# EAGLE design frontpanel1_1 (EAGLE 7.7.0)
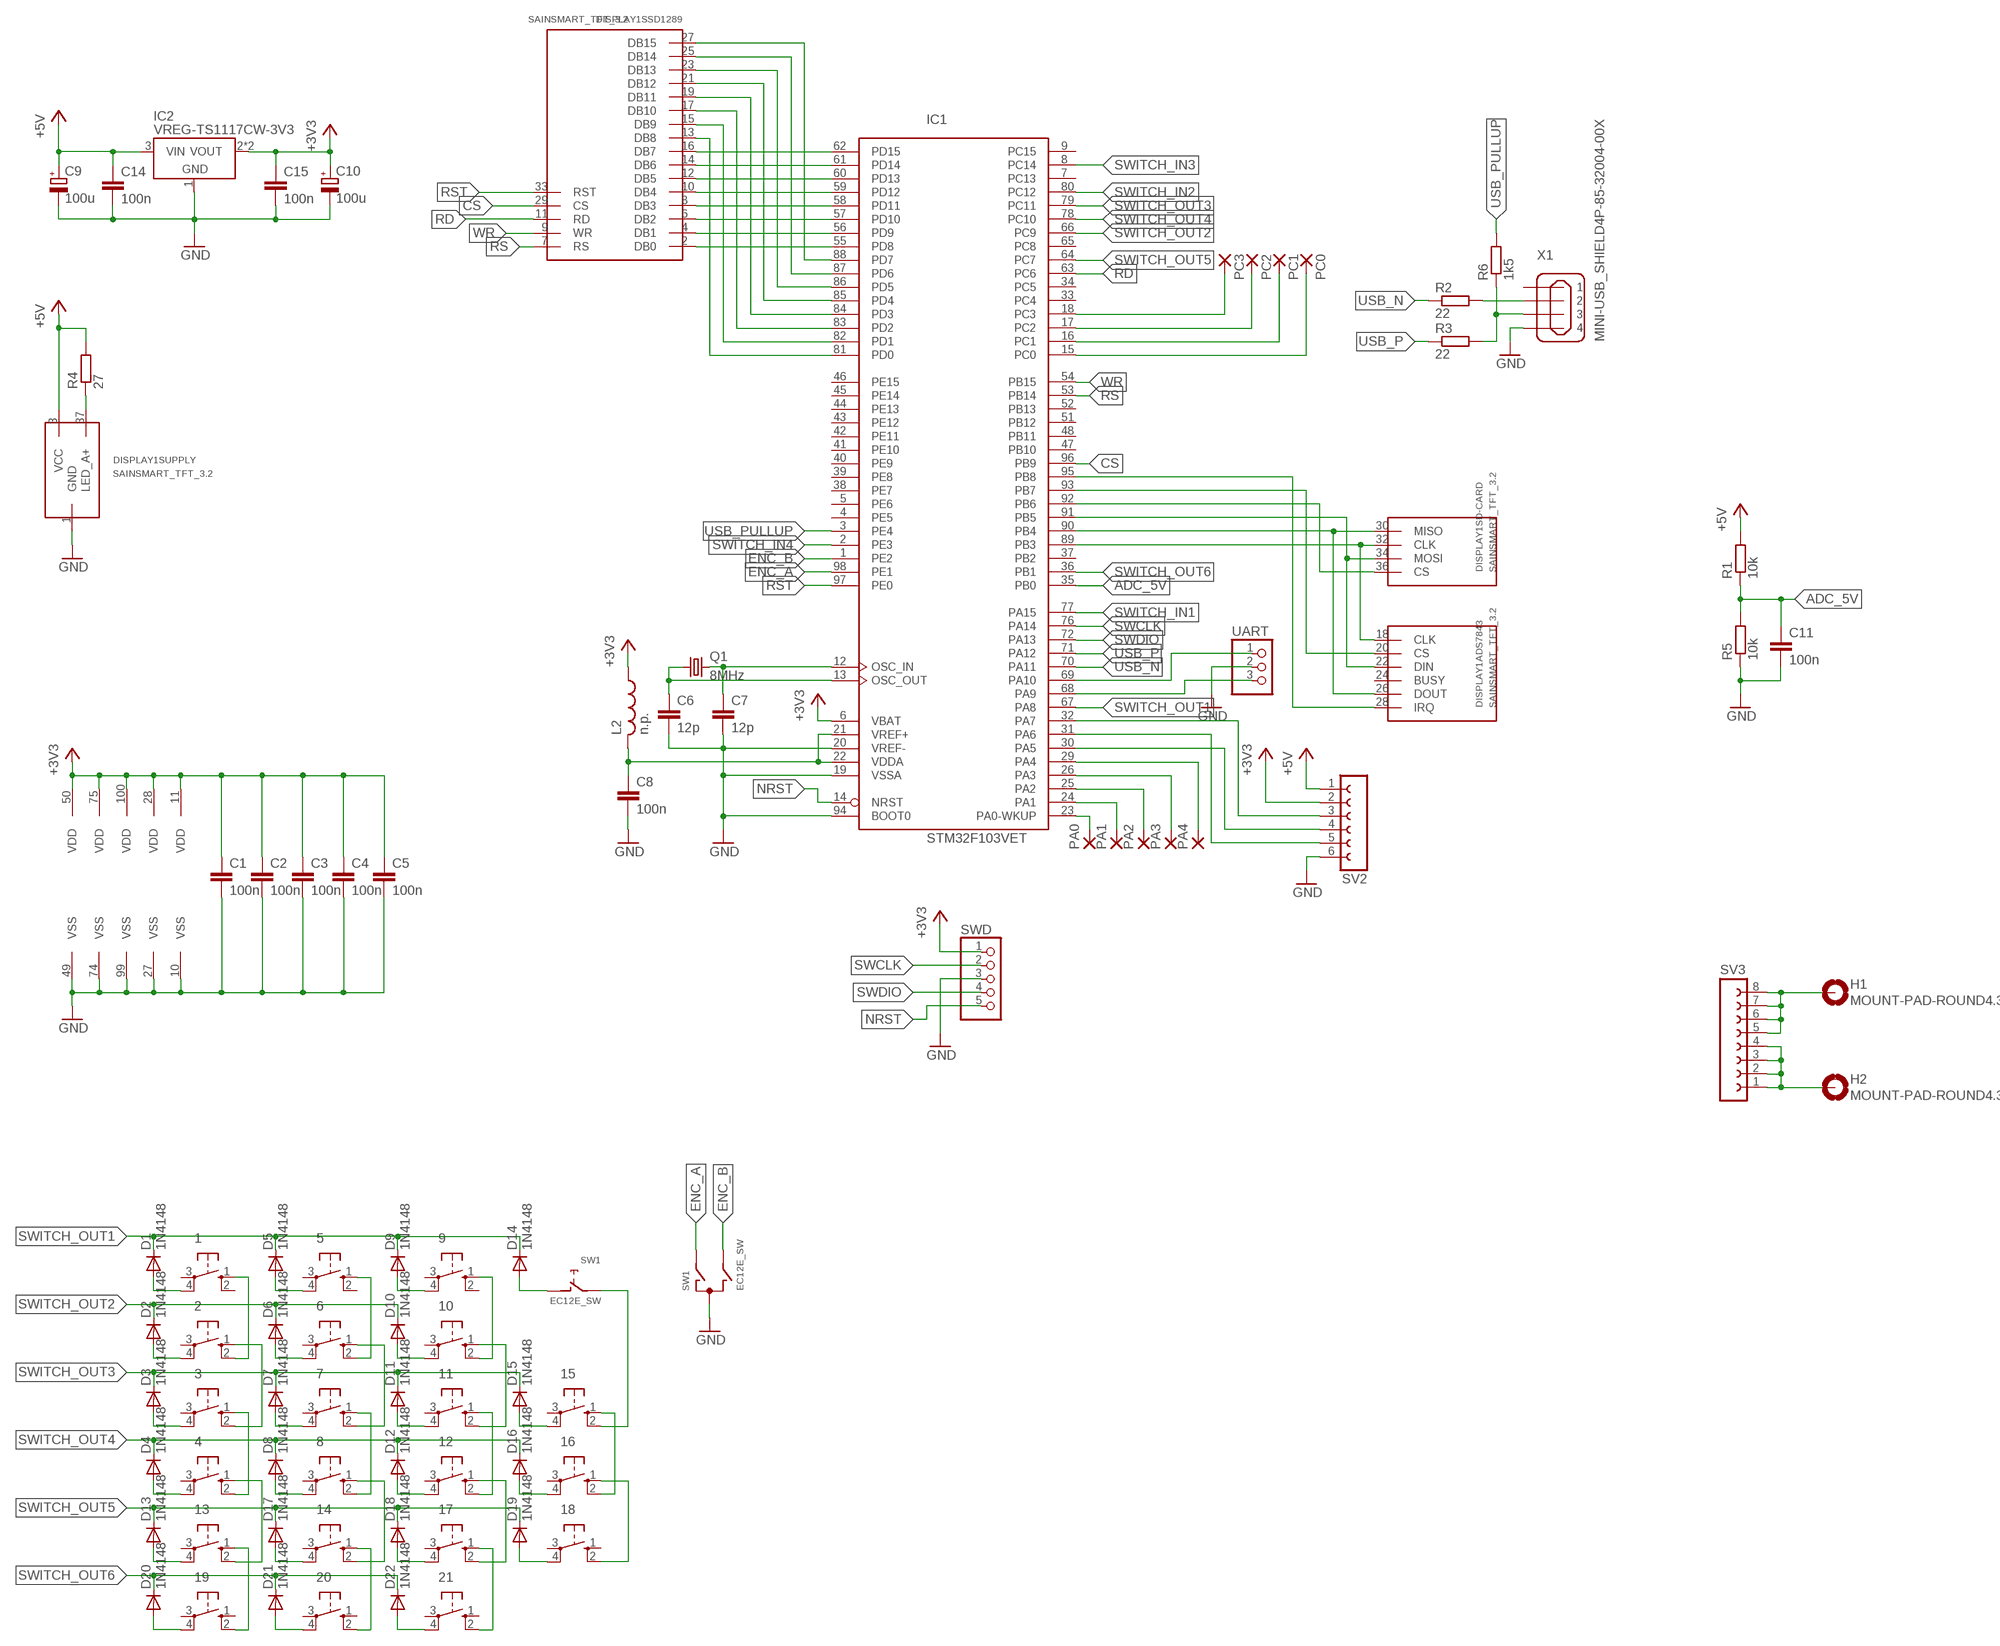
[diagram p0: schematic, sheet 1]

## Parts
1  10-XXSMD  [SMD]
2  10-XXSMD  [SMD]
3  10-XXSMD  [SMD]
4  10-XXSMD  [SMD]
5  10-XXSMD  [SMD]
6  10-XXSMD  [SMD]
7  10-XXSMD  [SMD]
8  10-XXSMD  [SMD]
9  10-XXSMD  [SMD]
10  10-XXSMD  [SMD]
11  10-XXSMD  [SMD]
12  10-XXSMD  [SMD]
13  10-XXSMD  [SMD]
14  10-XXSMD  [SMD]
15  10-XXSMD  [SMD]
16  10-XXSMD  [SMD]
17  10-XXSMD  [SMD]
18  10-XXSMD  [SMD]
19  10-XXSMD  [SMD]
20  10-XXSMD  [SMD]
21  10-XXSMD  [SMD]
C1  100n  C-EUC0603K  [C0603K]
C2  100n  C-EUC0603K  [C0603K]
C3  100n  C-EUC0603K  [C0603K]
C4  100n  C-EUC0603K  [C0603K]
C5  100n  C-EUC0603K  [C0603K]
C6  12p  C-EUC0603K  [C0603K]
C7  12p  C-EUC0603K  [C0603K]
C8  100n  C-EUC0603K  [C0603K]
C9  100u  CPOL-EU153CLV-0505  [153CLV-0505]
C10  100u  CPOL-EU153CLV-0505  [153CLV-0505]
C11  100n  C-EUC0603K  [C0603K]
C14  100n  C-EUC0603K  [C0603K]
C15  100n  C-EUC0603K  [C0603K]
D1  1N4148  DIODE-SOD323-W  [SOD323-W]
D2  1N4148  DIODE-SOD323-W  [SOD323-W]
D3  1N4148  DIODE-SOD323-W  [SOD323-W]
D4  1N4148  DIODE-SOD323-W  [SOD323-W]
D5  1N4148  DIODE-SOD323-W  [SOD323-W]
D6  1N4148  DIODE-SOD323-W  [SOD323-W]
D7  1N4148  DIODE-SOD323-W  [SOD323-W]
D8  1N4148  DIODE-SOD323-W  [SOD323-W]
D9  1N4148  DIODE-SOD323-W  [SOD323-W]
D10  1N4148  DIODE-SOD323-W  [SOD323-W]
D11  1N4148  DIODE-SOD323-W  [SOD323-W]
D12  1N4148  DIODE-SOD323-W  [SOD323-W]
D13  1N4148  DIODE-SOD323-W  [SOD323-W]
D14  1N4148  DIODE-SOD323-W  [SOD323-W]
D15  1N4148  DIODE-SOD323-W  [SOD323-W]
D16  1N4148  DIODE-SOD323-W  [SOD323-W]
D17  1N4148  DIODE-SOD323-W  [SOD323-W]
D18  1N4148  DIODE-SOD323-W  [SOD323-W]
D19  1N4148  DIODE-SOD323-W  [SOD323-W]
D20  1N4148  DIODE-SOD323-W  [SOD323-W]
D21  1N4148  DIODE-SOD323-W  [SOD323-W]
D22  1N4148  DIODE-SOD323-W  [SOD323-W]
DISPLAY1  SAINSMART_TFT_3.2  [SAINSMART_TFT_3.2]
H1  MOUNT-PAD-ROUND4.3  [4,3-PAD]
H2  MOUNT-PAD-ROUND4.3  [4,3-PAD]
IC1  STM32F103VET  [LQFP100]
IC2  VREG-TS1117CW-3V3  [SOT223]
L2  n.p.  INDUCTOR0603  [R0603]
PA0  SMD2  [SMD1,27-2,54]
PA1  SMD2  [SMD1,27-2,54]
PA2  SMD2  [SMD1,27-2,54]
PA3  SMD2  [SMD1,27-2,54]
PA4  SMD2  [SMD1,27-2,54]
PC0  SMD2  [SMD1,27-2,54]
PC1  SMD2  [SMD1,27-2,54]
PC2  SMD2  [SMD1,27-2,54]
PC3  SMD2  [SMD1,27-2,54]
Q1  8MHz  CRYSTALSM49  [SM49]
R1  10k  R-EU_R0603  [R0603]
R2  22  R-EU_R0603  [R0603]
R3  22  R-EU_R0603  [R0603]
R4  27  R-EU_R1206  [R1206]
R5  10k  R-EU_R0603  [R0603]
R6  1k5  R-EU_R0603  [R0603]
SV2  FE06-1  [FE06]
SV3  FE08-1  [FE08]
SW1  EC12E_SW  [ALPS_EC12E_SW]
SWD  PINHD-1X5  [1X05]
UART  PINHD-1X3  [1X03]
X1  MINI-USB_SHIELD4P-85-32004-00X  [85-32004-00X]

## Nets
+3V3: C1.1 C2.1 C3.1 C4.1 C5.1 C10.+ C15.1 IC1.6(VBAT) IC1.11(VDD) IC1.28(VDD) IC1.50(VDD) IC1.75(VDD) IC1.100(VDD) IC2.2(VOUT) IC2.4(VOUT) L2.1 SV2.2 SWD.1
+5V: C9.+ C14.1 DISPLAY1.3(SUPPLY:VCC) IC2.3(VIN) R1.2 R4.2 SV2.1
ADC_5V: C11.1 IC1.35(PB0) R1.1 R5.2
CS: DISPLAY1.29(SSD1289:CS) IC1.96(PB9)
ENC_A: IC1.98(PE1) SW1.A
ENC_B: IC1.1(PE2) SW1.B
EXT4: C8.1 IC1.21(VREF+) IC1.22(VDDA) L2.2
GND: C1.2 C2.2 C3.2 C4.2 C5.2 C6.2 C7.2 C8.2 C9.- C10.- C11.2 C14.2 C15.2 DISPLAY1.1(SUPPLY:GND) IC1.10(VSS) IC1.19(VSSA) IC1.20(VREF-) IC1.27(VSS) IC1.49(VSS) IC1.74(VSS) IC1.94(BOOT0) IC1.99(VSS) IC2.1(GND) R5.1 SV2.6 SW1.C SWD.3 UART.2 X1.4
MISO: IC1.31(PA6) SV2.5
MOSI: IC1.32(PA7) SV2.3
N$1: IC1.15(PC0) PC0.1(P)
N$2: C7.1 IC1.12(OSC_IN) Q1.2
N$3: C6.1 IC1.13(OSC_OUT) Q1.1
N$4: DISPLAY1.2(SSD1289:DB0) IC1.55(PD8)
N$5: DISPLAY1.4(SSD1289:DB1) IC1.56(PD9)
N$6: DISPLAY1.6(SSD1289:DB2) IC1.57(PD10)
N$7: DISPLAY1.8(SSD1289:DB3) IC1.58(PD11)
N$8: DISPLAY1.10(SSD1289:DB4) IC1.59(PD12)
N$9: DISPLAY1.12(SSD1289:DB5) IC1.60(PD13)
N$10: DISPLAY1.14(SSD1289:DB6) IC1.61(PD14)
N$11: DISPLAY1.16(SSD1289:DB7) IC1.62(PD15)
N$12: DISPLAY1.15(SSD1289:DB9) IC1.82(PD1)
N$13: DISPLAY1.17(SSD1289:DB10) IC1.83(PD2)
N$14: DISPLAY1.13(SSD1289:DB8) IC1.81(PD0)
N$15: DISPLAY1.19(SSD1289:DB11) IC1.84(PD3)
N$16: DISPLAY1.21(SSD1289:DB12) IC1.85(PD4)
N$17: DISPLAY1.23(SSD1289:DB13) IC1.86(PD5)
N$18: DISPLAY1.25(SSD1289:DB14) IC1.87(PD6)
N$19: DISPLAY1.27(SSD1289:DB15) IC1.88(PD7)
N$20: 13.1(S) 19.2(S1)
N$21: 4.1(S) 13.2(S1)
N$22: 13.4(P1) D13.A
N$23: 14.4(P1) D17.A
N$24: 17.4(P1) D18.A
N$25: 18.4(P1) D19.A
N$26: 19.4(P1) D20.A
N$27: 20.4(P1) D21.A
N$28: 21.4(P1) D22.A
N$29: IC1.16(PC1) PC1.1(P)
N$30: IC1.17(PC2) PC2.1(P)
N$31: IC1.18(PC3) PC3.1(P)
N$32: IC1.23(PA0-WKUP) PA0.1(P)
N$33: 2.1(S) 3.2(S1)
N$34: 1.1(S) 2.2(S1)
N$35: 5.1(S) 6.2(S1)
N$36: 6.1(S) 7.2(S1)
N$37: IC1.24(PA1) PA1.1(P)
N$38: 8.1(S) 14.2(S1)
N$39: 14.1(S) 20.2(S1)
N$40: 17.1(S) 21.2(S1)
N$41: IC1.25(PA2) PA2.1(P)
N$42: R2.2 X1.2
N$43: R3.2 R6.1 X1.3
N$44: DISPLAY1.37(SUPPLY:LED_A+) R4.1
N$45: IC1.26(PA3) PA3.1(P)
N$46: DISPLAY1.22(ADS7843:DIN) DISPLAY1.34(SD-CARD:MOSI) IC1.91(PB5)
N$47: 4.4(P1) D4.A
N$48: 3.4(P1) D3.A
N$49: 2.4(P1) D2.A
N$50: 1.4(P1) D1.A
N$51: DISPLAY1.26(ADS7843:DOUT) DISPLAY1.30(SD-CARD:MISO) IC1.90(PB4)
N$52: DISPLAY1.18(ADS7843:CLK) DISPLAY1.32(SD-CARD:CLK) IC1.89(PB3)
N$53: 11.1(S) 12.2(S1)
N$54: 8.4(P1) D8.A
N$55: 7.4(P1) D7.A
N$56: 6.4(P1) D6.A
N$57: 5.4(P1) D5.A
N$58: 10.1(S) 11.2(S1)
N$59: 9.1(S) 10.2(S1)
N$60: 15.1(S) 16.2(S1)
N$61: 12.4(P1) D12.A
N$62: 11.4(P1) D11.A
N$63: 10.4(P1) D10.A
N$64: 9.4(P1) D9.A
N$65: IC1.29(PA4) PA4.1(P)
N$66: DISPLAY1.36(SD-CARD:CS) IC1.92(PB6)
N$67: DISPLAY1.20(ADS7843:CS) IC1.93(PB7)
N$68: 16.4(P1) D16.A
N$69: 15.4(P1) D15.A
N$70: D14.A SW1.D
N$72: DISPLAY1.28(ADS7843:IRQ) IC1.95(PB8)
N$123: 15.2(S1) SW1.E
NRST: IC1.14(NRST) SWD.5
OUT+: H2.B4,3(MOUNT) SV3.1 SV3.2 SV3.3 SV3.4
OUT-: H1.B4,3(MOUNT) SV3.5 SV3.6 SV3.7 SV3.8
RD: DISPLAY1.11(SSD1289:RD) IC1.63(PC6)
RS: DISPLAY1.7(SSD1289:RS) IC1.53(PB14)
RST: DISPLAY1.33(SSD1289:RST) IC1.97(PE0)
RX: IC1.69(PA10) UART.1
SCK: IC1.30(PA5) SV2.4
SWCLK: IC1.76(PA14) SWD.2
SWDIO: IC1.72(PA13) SWD.4
SWITCH_IN1: 3.1(S) 4.2(S1) IC1.77(PA15)
SWITCH_IN2: 7.1(S) 8.2(S1) IC1.80(PC12)
SWITCH_IN3: 12.1(S) 17.2(S1) IC1.8(PC14)
SWITCH_IN4: 16.1(S) 18.2(S1) IC1.2(PE3)
SWITCH_OUT1: D1.C D5.C D9.C D14.C IC1.67(PA8)
SWITCH_OUT2: D2.C D6.C D10.C IC1.66(PC9)
SWITCH_OUT3: D3.C D7.C D11.C D15.C IC1.79(PC11)
SWITCH_OUT4: D4.C D8.C D12.C D16.C IC1.78(PC10)
SWITCH_OUT5: D13.C D17.C D18.C D19.C IC1.64(PC7)
SWITCH_OUT6: D20.C D21.C D22.C IC1.36(PB1)
TX: IC1.68(PA9) UART.3
USB_N: IC1.70(PA11) R2.1
USB_P: IC1.71(PA12) R3.1
USB_PULLUP: IC1.3(PE4) R6.2
WR: DISPLAY1.9(SSD1289:WR) IC1.54(PB15)
Unconnected: 1.2(S1) 1.3(P) 2.3(P) 3.3(P) 4.3(P) 5.2(S1) 5.3(P) 6.3(P) 7.3(P) 8.3(P) 9.2(S1) 9.3(P) 10.3(P) 11.3(P) 12.3(P) 13.3(P) 14.3(P) 15.3(P) 16.3(P) 17.3(P) 18.1(S) 18.3(P) 19.1(S) 19.3(P) 20.1(S) 20.3(P) 21.1(S) 21.3(P) DISPLAY1.24(ADS7843:BUSY) IC1.4(PE5) IC1.5(PE6) IC1.7(PC13) IC1.9(PC15) IC1.33(PC4) IC1.34(PC5) IC1.37(PB2) IC1.38(PE7) IC1.39(PE8) IC1.40(PE9) IC1.41(PE10) IC1.42(PE11) IC1.43(PE12) IC1.44(PE13) IC1.45(PE14) IC1.46(PE15) IC1.47(PB10) IC1.48(PB11) IC1.51(PB12) IC1.52(PB13) IC1.65(PC8) SW1.GND1(G) SW1.GND2(G) X1.1 X1.M1(S1) X1.M2(S2)

## Library data of the parts
1-21 = switch-omron:10-XX: OMRON SWITCH
C1-C8 = rcl:C-EU: CAPACITOR, European symbol
C9 C10 = rcl:CPOL-EU: POLARIZED CAPACITOR, European symbol
C11 C14 C15 = resistormod:C-EU: CAPACITOR, European symbol
D1-D22 = diode:DIODE-: DIODE
DISPLAY1 = sainsmart:SAINSMART_TFT_3.2
H1 H2 = holes:MOUNT-PAD-ROUND: MOUNTING PAD, round
IC1 = micro-stm_v3:STM32F103V*T: ARM 32-bit Cortex™-M3 CPU 72 MHz maximum frequency 64 to 1028 Kbytes of Flash memory 20 to 96 kbytes of SRAM 80 GPIOs 2.0 to 3.6 V application supply
IC2 = we-power:VREG: Voltage Regulators (LDOs, Switching Converters...) LDOs Taiwan Semi TS1117 800mA max 15V - compatible On Semi NCP1117 1A max 20V - compatible Diodes AP2111H 0.6A max 6V (0.25V@0.6A) - compatible Diodes AP2114H 1A max 6V (0.45V@1A) Taiwan Semi TS9011 250mA max 12V - compatible Diodes AP2210 300mA max 15V - compatible Microchip MCP1700 250mA max 6.5V - compatible Microchip MCP1702 250mA max 13V - compatible Microchip MCP1703 250mA max 16V - compatible Microchip MCP1754 150mA max 16V Taiwan Semi TS5204 150mA max 16V (low noise) DC/DC Converter Modules Recom R-78Ex.x-1.0-W36 1A max 28V - compatible CUI V78xx-2000 2A max 18V Murata OKI-78SR-x.x/1.5-W36 1.5A max 36V
L2 = xmaker:INDUCTOR: Inductor
PA0 PA1-PA4 PC0 PC1-PC3 = wirepad:SMD2: SMD PAD
Q1 = crystal:CRYSTAL: CRYSTAL; OC_FARNELL: unknown; OC_NEWARK: unknown
R1-R6 = resistor:R-EU_: RESISTOR, European symbol
SV2 = con-lsta:FE06-1: FEMALE HEADER; OC_FARNELL: unknown; OC_NEWARK: unknown
SV3 = con-lsta:FE08-1: FEMALE HEADER; OC_FARNELL: unknown; OC_NEWARK: unknown
SW1 = switch-alps:EC12E_SW: ALPS rotary Encoder EC12E series with switch; MPN: EC12E2424407; OC_FARNELL: 1520813; OC_NEWARK: 74M1068
SWD = pinhead:PINHD-1X5: PIN HEADER
UART = pinhead:PINHD-1X3: PIN HEADER
X1 = con-cypressindustries:MINI-USB_SHIELD4P-: MINI USB 4 Pol. Source: www.cypressindustries.com; OC_FARNELL: unknown; OC_NEWARK: unknown

## Board
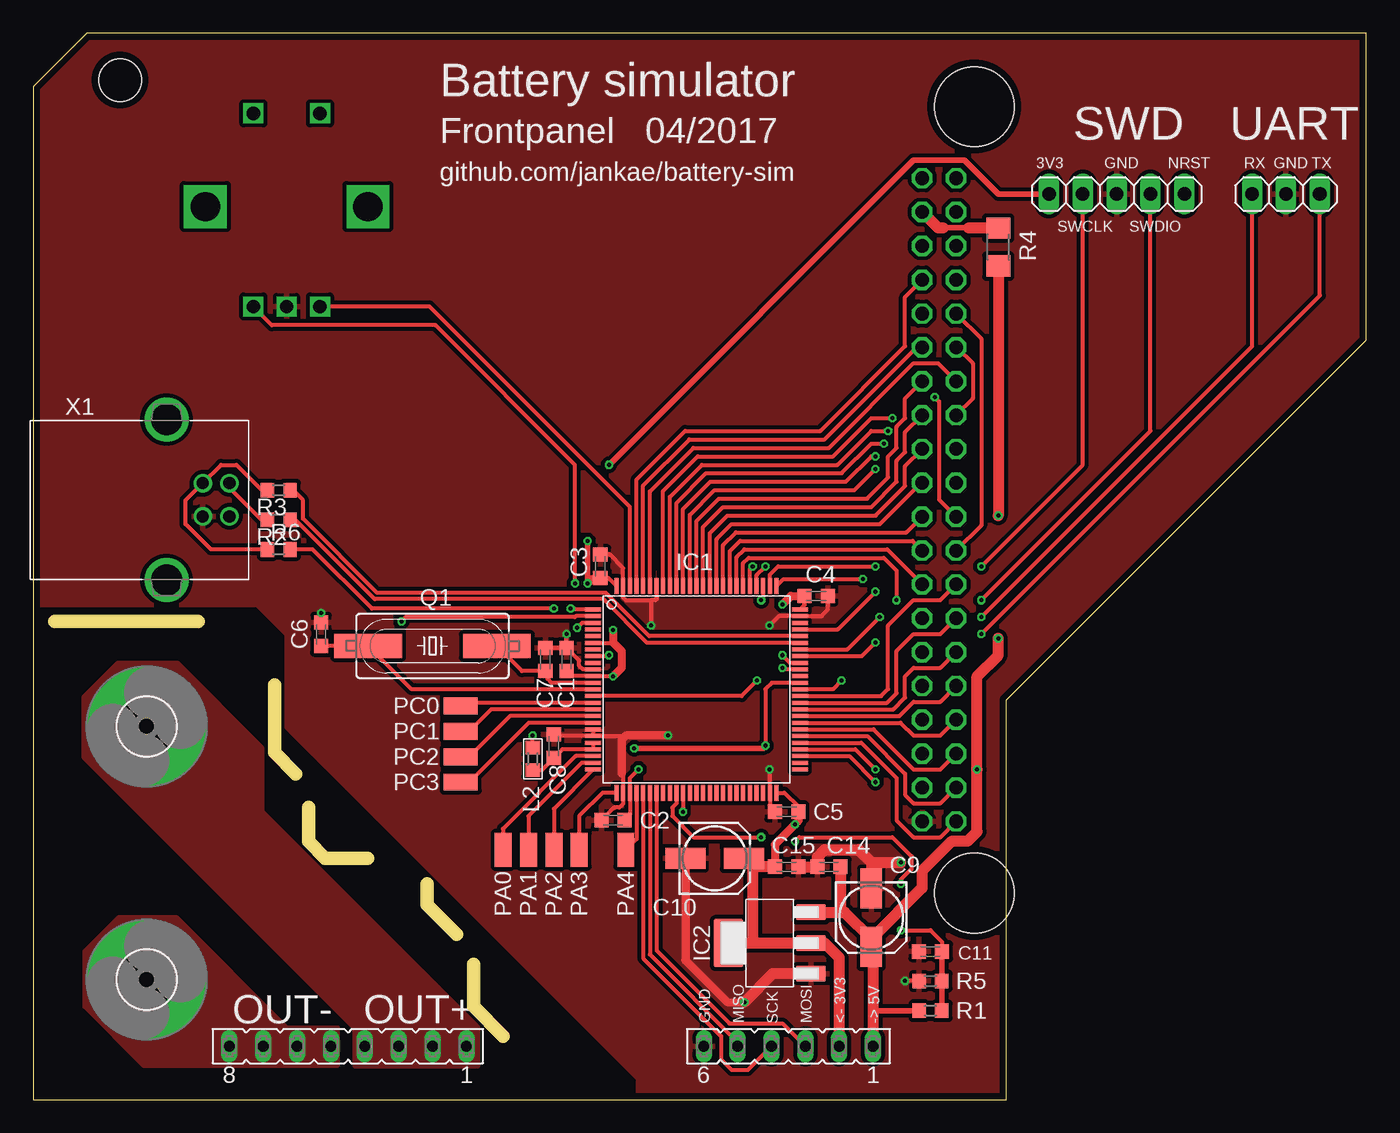
[diagram p1: board, top side]
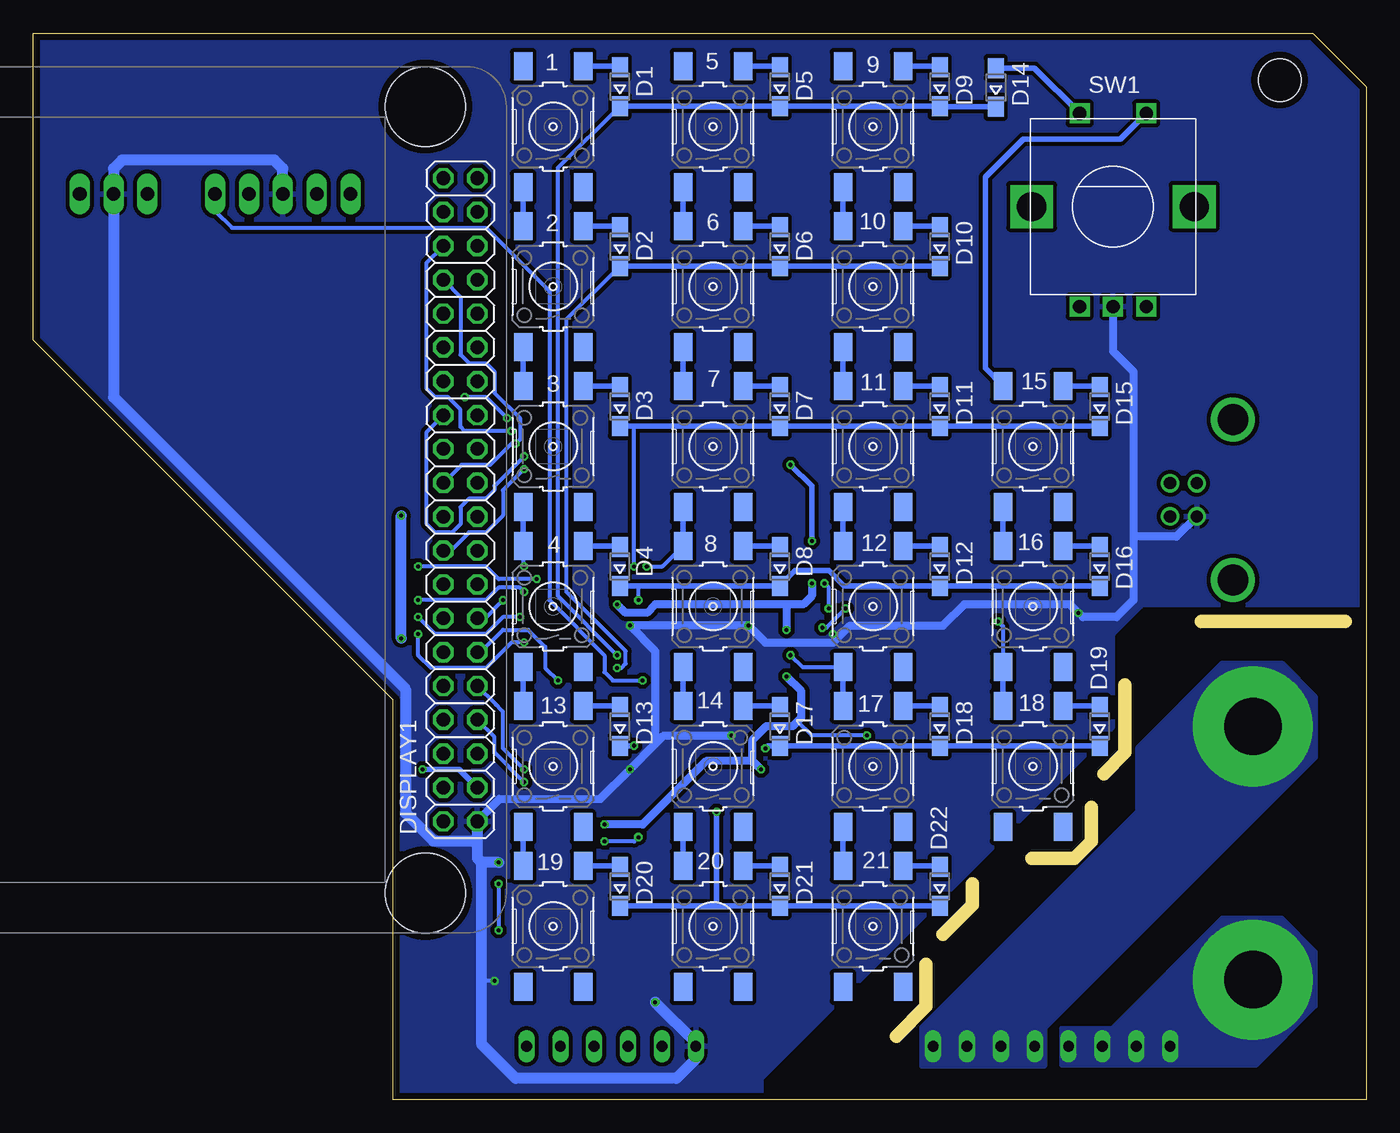
[diagram p2: board, bottom side, seen from below]

Size 100 x 80 mm. Coordinates in mm from the lower left corner, seen from the top.
Outline: 0,0 73,0 73,30 100,57 100,80 4,80 0,76 0,0
Copper layers (1*16): Top 0.035mm / dielectric 1.6mm / Bottom 0.035mm
Design rules "Elecrow_2-layer_PCB_eagle_rule": minimum track width 6mil, minimum drill 12mil, track to track 6mil, track to pad 6mil, pad to pad 6mil, via to via 8mil, smd to smd 0mil, copper to edge 20mil, drill to drill 10mil, minimum pad ring 6mil, minimum via ring 6mil, stop-mask expansion 0mil, vias tented up to drill 100mil, thermal gap 10mil
Holes 6 mm at 70.6,74.5 70.6,15.5
Holes 3.2 mm at 6.5,76.5
Milling: 10 lines

### Footprints (pad centres in the part's own frame; a part is rotated, then mirrored left to right if it is on the bottom)
SMD = smd 2.1 x 1.4: 1 -4.55,2.25; 2 4.55,2.25; 3 -4.55,-2.25; 4 4.55,-2.25
C0603K = smd 1.05 x 1.08: 1 -0.875,0; 2 0.875,0
153CLV-0505 = smd 3 x 1.6: + 2.2,0; - -2.2,0
SOD323-W = smd 1.5 x 1.2: A 1.45,0; C -1.45,0
SAINSMART_TFT_3.2 = drill 1.016 octagon: 1 2.19,56.63; 2 4.73,56.63; 3 2.19,54.09; 4 4.73,54.09; 5 2.19,51.55; 6 4.73,51.55; 7 2.19,49.01; 8 4.73,49.01; 9 2.19,46.47; 10 4.73,46.47; 11 2.19,43.93; 12 4.73,43.93; 13 2.19,41.39; 14 4.73,41.39; 15 2.19,38.85; 16 4.73,38.85; 17 2.19,36.31; 18 4.73,36.31; 19 2.19,33.77; 20 4.73,33.77; 21 2.19,31.23; 22 4.73,31.23; 23 2.19,28.69; 24 4.73,28.69; 25 2.19,26.15; 26 4.73,26.15; 27 2.19,23.61; 28 4.73,23.61; 29 2.19,21.07; 30 4.73,21.07; 31 2.19,18.53; 32 4.73,18.53; 33 2.19,15.99; 34 4.73,15.99; 35 2.19,13.45; 36 4.73,13.45; 37 2.19,10.91; 38 4.73,10.91; 39 2.19,8.37; 40 4.73,8.37
4,3-PAD = drill 4.3 pad 9: B4,3 0,0
LQFP100 = smd 0.3 x 1.2: 1 -6,-7.75; 2 -5.5,-7.75; 3 -5,-7.75; 4 -4.5,-7.75; 5 -4,-7.75; 6 -3.5,-7.75; 7 -3,-7.75; 8 -2.5,-7.75; 9 -2,-7.75; 10 -1.5,-7.75; 11 -1,-7.75; 12 -0.5,-7.75; 13 0,-7.75; 14 0.5,-7.75; 15 1,-7.75; 16 1.5,-7.75; 17 2,-7.75; 18 2.5,-7.75; 19 3,-7.75; 20 3.5,-7.75; 21 4,-7.75; 22 4.5,-7.75; 23 5,-7.75; 24 5.5,-7.75; 25 6,-7.75; 51 6,7.75; 52 5.5,7.75; 53 5,7.75; 54 4.5,7.75; 55 4,7.75; 56 3.5,7.75; 57 3,7.75; 58 2.5,7.75; 59 2,7.75; 60 1.5,7.75; 61 1,7.75; 62 0.5,7.75; 63 0,7.75; 64 -0.5,7.75; 65 -1,7.75; 66 -1.5,7.75; 67 -2,7.75; 68 -2.5,7.75; 69 -3,7.75; 70 -3.5,7.75; 71 -4,7.75; 72 -4.5,7.75; 73 -5,7.75; 74 -5.5,7.75; 75 -6,7.75 | smd 1.2 x 0.3: 26 7.75,-6; 27 7.75,-5.5; 28 7.75,-5; 29 7.75,-4.5; 30 7.75,-4; 31 7.75,-3.5; 32 7.75,-3; 33 7.75,-2.5; 34 7.75,-2; 35 7.75,-1.5; 36 7.75,-1; 37 7.75,-0.5; 38 7.75,0; 39 7.75,0.5; 40 7.75,1; 41 7.75,1.5; 42 7.75,2; 43 7.75,2.5; 44 7.75,3; 45 7.75,3.5; 46 7.75,4; 47 7.75,4.5; 48 7.75,5; 49 7.75,5.5; 50 7.75,6; 76 -7.75,6; 77 -7.75,5.5; 78 -7.75,5; 79 -7.75,4.5; 80 -7.75,4; 81 -7.75,3.5; 82 -7.75,3; 83 -7.75,2.5; 84 -7.75,2; 85 -7.75,1.5; 86 -7.75,1; 87 -7.75,0.5; 88 -7.75,0; 89 -7.75,-0.5; 90 -7.75,-1; 91 -7.75,-1.5; 92 -7.75,-2; 93 -7.75,-2.5; 94 -7.75,-3; 95 -7.75,-3.5; 96 -7.75,-4; 97 -7.75,-4.5; 98 -7.75,-5; 99 -7.75,-5.5; 100 -7.75,-6
SOT223 = smd 2.235 x 1.219: 1 -3.099,2.311; 2 -3.099,0; 3 -3.099,-2.311 | smd 2.2 x 3.6: 4 3.099,0
R0603 = smd 1.1 x 1: 1 0,-0.85; 2 0,0.85
SMD1,27-2,54 = smd 1.27 x 2.54: 1 0,0
SM49 = smd 5.08 x 1.778: 1 -4.826,0; 2 4.826,0
R0603' = smd 1 x 1.1: 1 -0.85,0; 2 0.85,0
R1206 = smd 1.6 x 1.803: 1 -1.422,0; 2 1.422,0
FE06 = drill 0.813 long: 1 -6.35,0; 2 -3.81,0; 3 -1.27,0; 4 1.27,0; 5 3.81,0; 6 6.35,0
FE08 = drill 0.813 long: 1 -8.89,0; 2 -6.35,0; 3 -3.81,0; 4 -1.27,0; 5 1.27,0; 6 3.81,0; 7 6.35,0; 8 8.89,0
ALPS_EC12E_SW = drill 1 square: A -2.5,-7.5; B 2.5,-7.5; C 0,-7.5; D -2.5,7; E 2.5,7 | drill 2.2 square: GND1 -6.1,0; GND2 6.1,0
1X05 = drill 1.016 long: 1 -5.08,0; 2 -2.54,0; 3 0,0; 4 2.54,0; 5 5.08,0
1X03 = drill 1.016 long: 1 -2.54,0; 2 0,0; 3 2.54,0
85-32004-00X = drill 0.92 pad 1.27: 1 4.71,-1.25; 2 4.71,1.25; 3 2.71,1.25; 4 2.71,-1.25 | drill 2.3 pad 3: M1 0,6.02; M2 0,-6.02

### Placement (x,y rotation side)
1  61,73 90 bottom
2  61,61 90 bottom
3  61,49 90 bottom
4  61,37 90 bottom
5  49,73 90 bottom
6  49,61 90 bottom
7  49,49 90 bottom
8  49,37 90 bottom
9  37,73 90 bottom
10  37,61 90 bottom
11  37,49 90 bottom
12  37,37 90 bottom
13  61,25 90 bottom
14  49,25 90 bottom
15  25,49 90 bottom
16  25,37 90 bottom
17  37,25 90 bottom
18  25,25 90 bottom
19  61,13 90 bottom
20  49,13 90 bottom
21  37,13 90 bottom
C1  40.01,33.02 90 top
C2  43.5,20.95 180 top
C3  42.55,40.01 90 top
C4  58.74,37.78 0 top
C5  56.52,21.59 180 top
C6  21.59,34.92 90 top
C7  38.42,33.02 90 top
C8  39.05,26.51 90 top
C9  62.87,13.65 270 top
C10  51.12,18.1 0 top
C11  67.31,11.11 180 top
C14  59.69,17.46 180 top
C15  56.52,17.46 0 top
D1  56,76 90 bottom
D2  56,64 90 bottom
D3  56,52 90 bottom
D4  56,40 90 bottom
D5  44,76 90 bottom
D6  44,64 90 bottom
D7  44,52 90 bottom
D8  44,40 90 bottom
D9  32,76 90 bottom
D10  32,64 90 bottom
D11  32,52 90 bottom
D12  32,40 90 bottom
D13  56,28 90 bottom
D14  27.79,75.93 90 bottom
D15  20,52 90 bottom
D16  20,40 90 bottom
D17  44,28 90 bottom
D18  32,28 90 bottom
D19  20,28 90 bottom
D20  56,16 90 bottom
D21  44,16 90 bottom
D22  32,16 90 bottom
DISPLAY1  64.5,77.5 180 bottom
H1  8.5,9 0 top
H2  8.5,28 0 top
IC1  49.76,30.77 270 top
IC2  55.24,11.75 180 top
L2  37.47,25.56 180 top
PA0  35.24,18.73 0 top
PA1  37.15,18.73 0 top
PA2  39.05,18.73 0 top
PA3  40.96,18.73 0 top
PA4  44.45,18.73 0 top
PC0  32.07,29.53 90 top
PC1  32.07,27.62 90 top
PC2  32.07,25.72 90 top
PC3  32.07,23.81 90 top
Q1  29.95,34.04 0 top
R1  10k  [R0603']  67.31,6.67 180 top
R2  22  [R0603']  18.41,43.5 180 top
R3  22  [R0603']  18.41,45.72 180 top
R4  72.4,63.96 270 top
R5  10k  [R0603']  67.31,8.89 0 top
R6  1k5  [R0603']  18.41,41.27 0 top
SV2  56.65,4 180 top
SV3  23.6,4 180 top
SW1  19,67 0 bottom
SWD  81.28,67.94 0 top
UART  93.98,67.94 0 top
X1  10,45 0 top

### Tracks (layer width: path | path; a pad name or v marks a point on that pad's centre or on a via)
+3V3  (via drill 0.3)
  Top 0.305: C2.1 44.76,21.34 IC1.28 44.76,24.12 v45.4,24.77 | IC1.50 56.35,23.02 57.39,21.98 C5.1 | IC1.75 57.86,37.12 C4.1 | C3.1 43.15,39.13 IC1.100 43.23,39.05 42.55,39.05 | v43.5,31.75 42.03,31.75 IC1.11 40.38,31.77 C1.1 | IC1.6 43.48,34.27 43.5,34.29 | L2.1 v37.47,27.3
  Top 0.406: SWD.1 72.39,67.94 69.85,70.48 66.04,70.48 v43.18,47.62 | v41.59,41.91 v41.59,38.73
  Top 0.61: 42.55,39.05 41.91,39.05 v41.59,38.73 | v56.2,37.15 56.83,37.78 C4.1 | v43.5,35.24 43.5,34.29 44.13,33.66 44.13,32.38 v43.5,31.75 | C5.1 57.39,20.88 v57.15,20.64 55.64,19.13 C15.1
  Top 0.813: IC2.4 53.98,11.75 | 53.98,11.75 IC2.2 59.37,11.75 60.46,10.66 SV2.2 | C15.1 53.95,17.46 | 53.95,17.46 C10.+ | 53.95,17.46 53.95,11.77 53.98,11.75
  Bottom 0.305: v37.47,27.3 41.59,27.3 42.66,28.38
  Bottom 0.406: v43.18,47.62 41.59,46.04 v41.59,41.91
  Bottom 0.61: v41.59,38.73 41.59,37.78 42.23,37.15 43.5,37.15 | 43.5,37.15 53.34,37.15 53.98,36.51 55.56,36.51 v56.2,37.15 | 43.5,37.15 v43.5,35.24 | v45.4,24.77 46.04,25.4 | 46.04,25.4 46.04,26.99 45.01,28.02 43.02,28.02 42.66,28.38 42.39,28.65 42.39,30.64 v43.5,31.75 | 46.04,25.4 49.53,25.4 54.29,20.64 v57.15,20.64
+5V  (via drill 0.3)
  Top 0.406: R1.2 63,6.67
  Top 0.813: R4.2 v72.4,43.81 | v72.39,34.61 72.39,33.34 70.8,31.75 v70.8,24.77 70.8,20.1 70.1,19.4 68.93,19.4 66.67,17.14 66.67,15.88 62.87,12.06 | IC2.3 60.64,14.06 | 60.64,14.06 60.87,14.06 62.87,12.06 | 62.87,12.06 C9.+ 63,11.32 63,6.67 SV2.1 | C14.1 60.56,14.14 60.64,14.06
  Bottom 0.406: DISPLAY1.3 68.05,24.77 v70.8,24.77
  Bottom 0.813: v72.39,34.61 v72.4,34.62 v72.4,43.81
ADC_5V  (via drill 0.3)
  Top 0.305: IC1.35 48.26,22.23 47.94,21.91 47.94,21.27 49.53,19.68 v54.61,19.68 | v57.15,19.37 57.47,19.68 64.45,19.68 65.88,18.26 65.88,17.3 65.09,16.51 v65.09,16.19 | v65.09,12.7 67.31,12.7 68.19,11.82 C11.1
  Top 0.406: R1.1 R5.2 68.19,8.89 C11.1
  Bottom 0.305: v54.61,19.68 54.93,19.37 v57.15,19.37 | v65.09,16.19 v65.09,12.7
CS
  Top 0.305: IC1.96 45.76,46.08 49.21,49.53 59.37,49.53 66.27,56.43 DISPLAY1.29
ENC_A
  Top 0.305: IC1.98 44.76,44.46 29.72,59.5 SW1.A
ENC_B  (via drill 0.3)
  Top 0.305: v40.64,38.73 40.64,47.62 30.16,58.1 17.9,58.1 SW1.B | IC1.1 40.38,36.77 v40.32,36.83
  Bottom 0.305: v40.32,36.83 40.32,38.42 v40.64,38.73
EXT4
  Top 0.305: IC1.21 IC1.22 39.69,26.27 C8.1 38.12,24.71 L2.2
GND  (via drill 0.3)
  Top 0.305: IC1.94 46.76,37.55 46.67,37.47 46.35,37.47 | C2.2 43.58,21.91 43.97,21.91 44.26,22.19 IC1.27 44.26,24.32 44.13,24.45 | IC1.10 41.23,32.27 40.96,32.54 40.96,32.94 C1.2 | C1.2 C7.2 | IC1.20 39.17,27.27 C8.2 | IC1.19 IC1.20 | C5.2 55.26,21.97 IC1.49 55.26,24.75 v55.24,24.77 | C4.2 59.61,36.75 59.13,36.27 IC1.74 55.96,36.27 v55.24,35.56 | C3.2 43.26,40.88 44.26,39.88 IC1.99 44.26,37.65 44.45,37.47 46.35,37.47 | C6.2 v21.59,36.51 | C1.2 v40.01,34.92 | 46.35,37.47 v46.35,35.56 | IC1.20 44.42,27.27 44.45,27.3 | R5.1 v65.41,8.89
  Top 0.61: v47.62,27.3 44.45,27.3 44.13,26.99 44.13,24.45 | C10.- 48.92,10.46 52.07,7.3 v53.34,7.3
  Top 0.813: C15.2 C14.2 58.81,18.18 59.37,18.73 61.91,18.73 62.87,17.78 | 62.87,17.78 C9.- | IC2.1 55.47,9.44 v53.34,7.3 | 62.87,17.78 v65.09,17.78
  Bottom 0.305: v65.41,8.89 66.36,8.89
  Bottom 0.61: SW1.C 19,56.15 17.46,54.61 17.46,42.23 | 17.46,42.23 17.46,37.47 18.73,36.2 21.27,36.2 v21.59,36.51 22.23,37.15 30.16,37.15 31.75,35.56 38.73,35.56 40.01,34.29 45.09,34.29 v46.35,35.56 v55.24,35.56 53.34,33.66 53.34,26.67 | X1.4 14.23,42.23 17.46,42.23 | DISPLAY1.1 65.02,22.54 | 65.02,22.54 57.47,22.54 v55.24,24.77 53.34,26.67 | 65.02,22.54 65.09,22.54 | 53.34,26.67 52.7,27.3 v47.62,27.3
  Bottom 0.813: SWD.3 81.28,69.85 81.92,70.48 93.34,70.48 93.98,69.85 UART.2 93.98,52.7 72.07,30.8 72.07,21.49 69.98,19.4 66.7,19.4 | v53.34,7.3 50.3,4.26 SV2.6 50.3,3.04 51.75,1.59 63.82,1.59 66.36,4.13 66.36,8.89 66.36,17.78 | 66.36,17.78 66.67,18.1 66.67,20.64 | v65.09,17.78 66.36,17.78
  pour Bottom (isolate 0.305, rank 6): -0.64,80.96 101.92,80.96 101.92,-1.27 45.4,-1.27 45.4,1.59 19.05,27.94 19.05,34.92 16.83,37.15 -0.64,37.15
  pour Top (isolate 0.305, rank 6): -0.95,81.28 101.6,81.28 101.6,-0.95 45.4,-0.95 45.4,1.59 19.05,27.94 19.05,34.92 16.83,37.15 -0.95,37.15
MISO
  Top 0.305: IC1.31 46.26,10.89 52.84,4.31 SV2.5
MOSI
  Top 0.305: IC1.32 46.76,11.18 52.23,5.71 56.2,5.71 SV2.3
N$1
  Top 0.305: IC1.15 32.31,29.77 PC0.1
N$2
  Top 0.305: IC1.12 38.9,31.27 38.58,31.59 C7.1 36.67,32.15 Q1.2
N$3
  Top 0.305: IC1.13 28.39,30.77 Q1.1 21.6,34.04 C6.1
N$4
  Top 0.305: IC1.55 62.13,26.77 64.77,24.13 64.77,20.95 66.04,19.68 68.05,19.68 DISPLAY1.2
N$5
  Top 0.305: IC1.56 62.58,27.27 65.41,24.45 65.41,22.86 66.04,22.23 68.05,22.23 DISPLAY1.4
N$6
  Top 0.305: IC1.57 63.03,27.77 66.04,24.77 68.05,24.77 DISPLAY1.6
N$7
  Top 0.305: IC1.58 65.07,28.27 66.04,27.3 68.05,27.3 DISPLAY1.8
N$8
  Top 0.305: IC1.59 64.97,28.77 66.04,29.84 68.05,29.84 DISPLAY1.10
N$9
  Top 0.305: IC1.60 64.52,29.27 65.41,30.16 65.41,31.75 66.04,32.38 68.05,32.38 DISPLAY1.12
N$10
  Top 0.305: IC1.61 64.06,29.77 64.77,30.48 64.77,33.66 66.04,34.92 68.05,34.92 DISPLAY1.14
N$11
  Top 0.305: IC1.62 63.61,30.27 64.14,30.8 64.14,35.56 66.04,37.47 68.05,37.47 DISPLAY1.16
N$12
  Top 0.305: IC1.82 52.76,40.7 53.34,41.27 64.06,41.27 DISPLAY1.15
N$13
  Top 0.305: IC1.83 52.26,41.15 53.02,41.91 65.97,41.91 DISPLAY1.17
N$14  (via drill 0.3)
  Top 0.305: IC1.81 53.26,40.24 53.66,40.64 63.82,40.64 64.77,39.69 v64.77,37.47
  Bottom 0.305: v64.77,37.47 66.12,36.11 DISPLAY1.13
N$15
  Top 0.305: IC1.84 51.76,41.6 52.7,42.55 65.5,42.55 DISPLAY1.19
N$16
  Top 0.305: IC1.85 51.26,42.05 52.39,43.18 63.5,43.18 66.59,46.27 DISPLAY1.21
N$17
  Top 0.305: IC1.86 50.76,42.51 52.07,43.81 63.18,43.81 65.41,46.04 65.41,47.52 DISPLAY1.23
N$18
  Top 0.305: IC1.87 50.26,42.96 51.75,44.45 62.87,44.45 64.77,46.35 64.77,47.94 65.41,48.58 65.41,50.06 DISPLAY1.25
N$19
  Top 0.305: IC1.88 49.76,43.41 51.44,45.09 62.55,45.09 64.14,46.67 64.14,48.26 64.77,48.9 64.77,50.48 65.41,51.12 65.41,52.6 DISPLAY1.27
N$20
  Bottom 0.406: 13.1 19.2
N$21
  Bottom 0.406: 4.1 13.2
N$22
  Bottom 0.406: 13.4 56.1,29.55 D13.A
N$23
  Bottom 0.406: 14.4 44.1,29.55 D17.A
N$24
  Bottom 0.406: 17.4 32.1,29.55 D18.A
N$25
  Bottom 0.406: 18.4 20.1,29.55 D19.A
N$26
  Bottom 0.406: 19.4 56.1,17.55 D20.A
N$27
  Bottom 0.406: 20.4 44.1,17.55 D21.A
N$28
  Bottom 0.406: 21.4 32.1,17.55 D22.A
N$29
  Top 0.305: IC1.16 34.35,29.27 32.7,27.62 PC1.1
N$30
  Top 0.305: IC1.17 35.76,28.77 32.7,25.72 PC2.1
N$31
  Top 0.305: IC1.18 37.16,28.27 32.7,23.81 PC3.1
N$32
  Top 0.305: IC1.23 40.7,25.77 35.24,20.32 PA0.1
N$33
  Bottom 0.406: 2.1 3.2
N$34
  Bottom 0.406: 1.1 2.2
N$35
  Bottom 0.406: 6.2 5.1
N$36
  Bottom 0.406: 7.2 6.1
N$37
  Top 0.305: IC1.24 41.15,25.27 37.15,21.27 PA1.1 37.15,19.68
N$38
  Bottom 0.406: 14.2 8.1
N$39
  Bottom 0.406: 20.2 14.1
N$40
  Bottom 0.406: 21.2 17.1
N$41
  Top 0.305: IC1.25 39.05,21.81 PA2.1
N$42
  Top 0.305: X1.2 14.71,45.93 17.14,43.5 R2.2
N$43
  Top 0.305: R3.2 17.14,45.72 15.24,47.62 14.09,47.62 X1.3 11.43,44.97 11.43,43.18 13.34,41.27 R6.1
N$44
  Top 0.406: 71.81,65.41 R4.1 | 68.26,65.41 70.17,65.41
  Top 0.813: DISPLAY1.37 67.88,65.41 68.26,65.41 | 70.17,65.41 72.38,65.41 R4.1
N$45
  Top 0.305: IC1.26 42.71,23.02 40.96,21.27 PA3.1
N$46  (via drill 0.3)
  Top 0.305: IC1.91 48.26,44.77 50.48,46.99 60.64,46.99 62.87,49.21 v63.82,49.21
  Bottom 0.305: DISPLAY1.22 67.88,47.62 65.72,47.62 64.14,49.21 v63.82,49.21 63.5,49.53 63.5,51.12 65.41,53.02 65.41,54.61 66.04,55.24 67.31,55.24 67.94,55.88 67.94,60.23 DISPLAY1.34
N$47
  Bottom 0.406: 4.4 56.1,41.55 D4.A
N$48
  Bottom 0.406: 3.4 56.1,53.55 D3.A
N$49
  Bottom 0.406: 2.4 56.1,65.55 D2.A
N$50
  Bottom 0.406: 1.4 56.1,77.55 D1.A
N$51  (via drill 0.3)
  Top 0.305: IC1.90 48.76,44.32 50.8,46.35 60.96,46.35 62.87,48.26 v63.18,48.26 | DISPLAY1.30 69.3,56.43 70.48,55.24 70.48,52.6 DISPLAY1.26
  Bottom 0.305: v63.18,48.26 65.41,46.04 65.41,45.72 66.04,45.09 67.31,45.09 67.94,44.45 67.94,43.18 68.58,42.55 69.85,42.55 70.48,43.18 70.48,50.09 DISPLAY1.26
N$52  (via drill 0.3)
  Top 0.305: IC1.89 49.26,43.86 51.12,45.72 61.59,45.72 v63.18,47.31 | DISPLAY1.32 71.12,57.08 71.12,43.08 DISPLAY1.18
  Bottom 0.305: v63.18,47.31 64.77,45.72 64.77,43.81 66.04,42.55 67.31,42.55 68.67,41.19 DISPLAY1.18
N$53
  Bottom 0.406: 12.2 11.1
N$54
  Bottom 0.406: 8.4 44.1,41.55 D8.A
N$55
  Bottom 0.406: 7.4 44.1,53.55 D7.A
N$56
  Bottom 0.406: 6.4 44.1,65.55 D6.A
N$57
  Bottom 0.406: 5.4 44.1,77.55 D5.A
N$58
  Bottom 0.406: 11.2 10.1
N$59
  Bottom 0.406: 10.2 9.1 | 9.1 39.69,68.9 39.69,68.89 9.1
N$60
  Bottom 0.406: 16.2 15.1
N$61
  Bottom 0.406: 12.4 32.1,41.55 D12.A
N$62
  Bottom 0.406: 11.4 32.1,53.55 D11.A
N$63
  Bottom 0.406: 10.4 32.1,65.55 D10.A
N$64
  Bottom 0.406: 9.4 32.1,77.55 D9.A
N$65
  Top 0.305: IC1.29 45.26,19.54 PA4.1
N$66  (via drill 0.3)
  Top 0.305: IC1.92 47.76,45.22 50.16,47.62 60.33,47.62 62.87,50.16 v64.14,50.16
  Bottom 0.305: v64.14,50.16 67.63,50.16 67.94,50.48 67.94,51.75 68.9,52.7 69.85,52.7 70.48,53.34 70.48,62.8 DISPLAY1.36
N$67  (via drill 0.3)
  Top 0.305: IC1.93 47.26,45.67 49.85,48.26 60.01,48.26 62.87,51.12 v64.45,51.12 | v67.63,52.7 67.94,52.39 67.94,45.02 DISPLAY1.20
  Bottom 0.305: v64.45,51.12 66.04,52.7 v67.63,52.7
N$68
  Bottom 0.406: 16.4 20.1,41.55 D16.A
N$69
  Bottom 0.406: 15.4 20.1,53.55 D15.A
N$70
  Bottom 0.406: SW1.D 24.88,77.38 D14.A
N$72
  Top 0.305: IC1.95 46.26,45.63 49.53,48.9 59.69,48.9 66.04,55.24 67.88,55.24 DISPLAY1.28
N$123
  Bottom 0.406: 15.2 28.57,54.88 28.57,69.22 25.72,72.07 18.43,72.07 SW1.E
NRST  (via drill 0.3)
  Top 0.305: v54.29,31.43 53.13,30.27 IC1.14
  Bottom 0.305: SWD.5 86.36,66.67 85.09,65.41 66.04,65.41 61.28,60.64 61.28,37.47 57.15,33.34 57.15,32.07 56.52,31.43 v54.29,31.43
OUT+
  pour Bottom (rank 6, no thermals): 24.13,2.54 33.34,2.54 33.34,5.4 17.14,21.59 17.14,26.35 10.79,32.7 6.35,32.7 3.81,30.16 3.81,25.72 24.13,5.4
  pour Top (rank 6, no thermals): 24.13,2.54 33.34,2.54 33.34,5.4 17.14,21.59 17.14,26.35 10.79,32.7 6.35,32.7 3.81,30.16 3.81,25.72 24.13,5.4
OUT-
  pour Top (no thermals): 22.86,2.54 22.86,5.4 19.05,5.4 10.79,13.65 6.35,13.65 3.81,11.11 3.81,6.99 8.26,2.54
  pour Bottom (no thermals): 22.86,2.54 22.86,5.4 19.05,5.4 10.79,13.65 6.35,13.65 3.81,11.11 3.81,6.99 8.26,2.54
RD  (via drill 0.3)
  Top 0.305: v60.64,31.43 59.98,30.77 IC1.63
  Bottom 0.305: DISPLAY1.11 66.44,33.57 64.77,35.24 62.87,35.24 61.59,33.97 61.59,32.38 v60.64,31.43
RS  (via drill 0.3)
  Top 0.305: IC1.53 61.22,25.77 v63.18,23.81
  Bottom 0.305: v63.18,23.81 65.41,26.04 65.41,27.2 DISPLAY1.7
RST
  Top 0.305: IC1.97 45.26,46.53 48.9,50.16 59.05,50.16 65.41,56.52 65.41,60.23 DISPLAY1.33
RX  (via drill 0.3)
  Top 0.305: IC1.69 61.08,33.77 v63.5,36.2 | v71.12,36.2 91.44,56.52 UART.1
  Bottom 0.305: v63.5,36.2 64.77,36.2 66.04,34.92 69.85,34.92 v71.12,36.2
SCK
  Top 0.305: IC1.30 45.76,10.6 51.59,4.76 51.59,3.02 52.39,2.22 53.6,2.22 SV2.4
SWCLK  (via drill 0.3)
  Top 0.305: IC1.76 56.29,39.05 v62.23,39.05 | v71.12,40.01 78.74,47.62 SWD.2
  Bottom 0.305: v62.23,39.05 65.09,39.05 66.04,40.01 v71.12,40.01
SWDIO  (via drill 0.3)
  Top 0.305: IC1.72 60.35,35.27 v63.18,38.1 | v71.12,37.47 83.82,50.16 SWD.4
  Bottom 0.305: v63.18,38.1 63.5,38.42 65.09,38.42 66.04,37.47 v71.12,37.47
SWITCH_IN1  (via drill 0.3)
  Top 0.305: IC1.77 55.26,39.39 55.88,40.01 v63.18,40.01
  Bottom 0.305: 4.2 63.25,40.07 v63.18,40.01
  Bottom 0.406: 3.1 4.2
SWITCH_IN2  (via drill 0.3)
  Top 0.305: IC1.80 53.76,39.79 v53.98,40.01
  Bottom 0.305: v53.98,40.01 52.8,40.01 8.2
  Bottom 0.406: 8.2 7.1
SWITCH_IN3  (via drill 0.3)
  Top 0.305: IC1.8 43.12,33.27 v43.18,33.34
  Bottom 0.305: v43.18,33.34 42.29,32.45 12.1
  Bottom 0.406: 17.2 12.1
SWITCH_IN4  (via drill 0.3)
  Top 0.305: IC1.2 40.72,36.27 40.64,36.2 27.94,36.2 v27.62,35.88
  Bottom 0.305: v27.62,35.88 27.25,35.51 16.1
  Bottom 0.406: 18.2 16.1
SWITCH_OUT1  (via drill 0.3)
  Top 0.305: IC1.67 56.76,32.77 v56.2,33.34
  Bottom 0.305: v56.2,33.34 60.64,37.78 60.64,69.91 D1.C
  Bottom 0.406: D14.C 31.93,74.48 D9.C D5.C D1.C
SWITCH_OUT2  (via drill 0.3)
  Top 0.305: IC1.66 56.31,32.27 v56.2,32.38
  Bottom 0.305: v56.2,32.38 55.88,32.38 55.56,32.7 55.56,33.66 60.01,38.1 60.01,58.54 D2.C
  Bottom 0.406: D10.C D6.C D2.C
SWITCH_OUT3  (via drill 0.3)
  Top 0.305: IC1.79 54.26,39.34 v54.93,40.01
  Bottom 0.305: v54.93,40.01 54.93,50.55
  Bottom 0.406: D15.C D11.C D7.C 54.93,50.55 D3.C
SWITCH_OUT4  (via drill 0.3)
  Top 0.305: IC1.78 54.76,37.62 v54.61,37.47
  Bottom 0.305: v54.61,37.47 54.61,38.55
  Bottom 0.406: D16.C D12.C 39.19,38.55 40.32,39.69 42.86,39.69 D8.C 54.61,38.55 D4.C
SWITCH_OUT5  (via drill 0.3)
  Top 0.305: IC1.64 55.4,31.27 54.93,30.8 v54.93,26.55
  Top 0.406: v54.93,26.55 54.73,26.35 v45.09,26.35
  Bottom 0.406: D19.C D18.C D17.C 44.89,26.55 v45.09,26.35 | v54.93,26.55 D13.C
SWITCH_OUT6  (via drill 0.3)
  Top 0.305: IC1.36 48.76,21.93 v48.74,21.59
  Bottom 0.406: D20.C 48.74,14.55 | 48.74,14.55 D21.C D22.C | v48.74,21.59 48.74,14.55
TX  (via drill 0.3)
  Top 0.305: IC1.68 62.16,33.27 v63.18,34.29 | v71.12,34.92 96.52,60.33 UART.3
  Bottom 0.305: v63.18,34.29 64.14,34.29 66.04,32.38 70.17,32.38 71.12,33.34 v71.12,34.92
USB_N
  Top 0.305: IC1.70 46.05,34.27 42.77,37.55 25.62,37.55 19.68,43.5 R2.1
USB_P
  Top 0.305: IC1.71 46.2,34.77 42.96,38.01 25.81,38.01 20.23,43.59 20.23,44.98 19.49,45.72 R3.1
USB_PULLUP  (via drill 0.3)
  Top 0.305: IC1.3 41.17,35.77 v40.8,35.4 | v39.05,36.83 25.4,36.83 20.95,41.27 R6.2
  Bottom 0.305: v40.8,35.4 40.48,35.4 v39.05,36.83
WR  (via drill 0.3)
  Top 0.305: IC1.54 61.67,26.27 v63.18,24.77
  Bottom 0.305: v63.18,24.77 64.77,26.35 64.77,29.11 64.87,29.21 65.3,29.64 DISPLAY1.9

### Text on the board
tPlace: Battery simulator | Frontpanel 04/2017 | 3V3 | GND | NRST | RX | GND | TX | github.com/jankae/battery-sim | SWCLK | SWDIO | OUT- | OUT+ | GND | MISO | SCK | MOSI | <- 3V3 | -> 5V